# Altium schematic sheet core_power.SchDoc
size A3
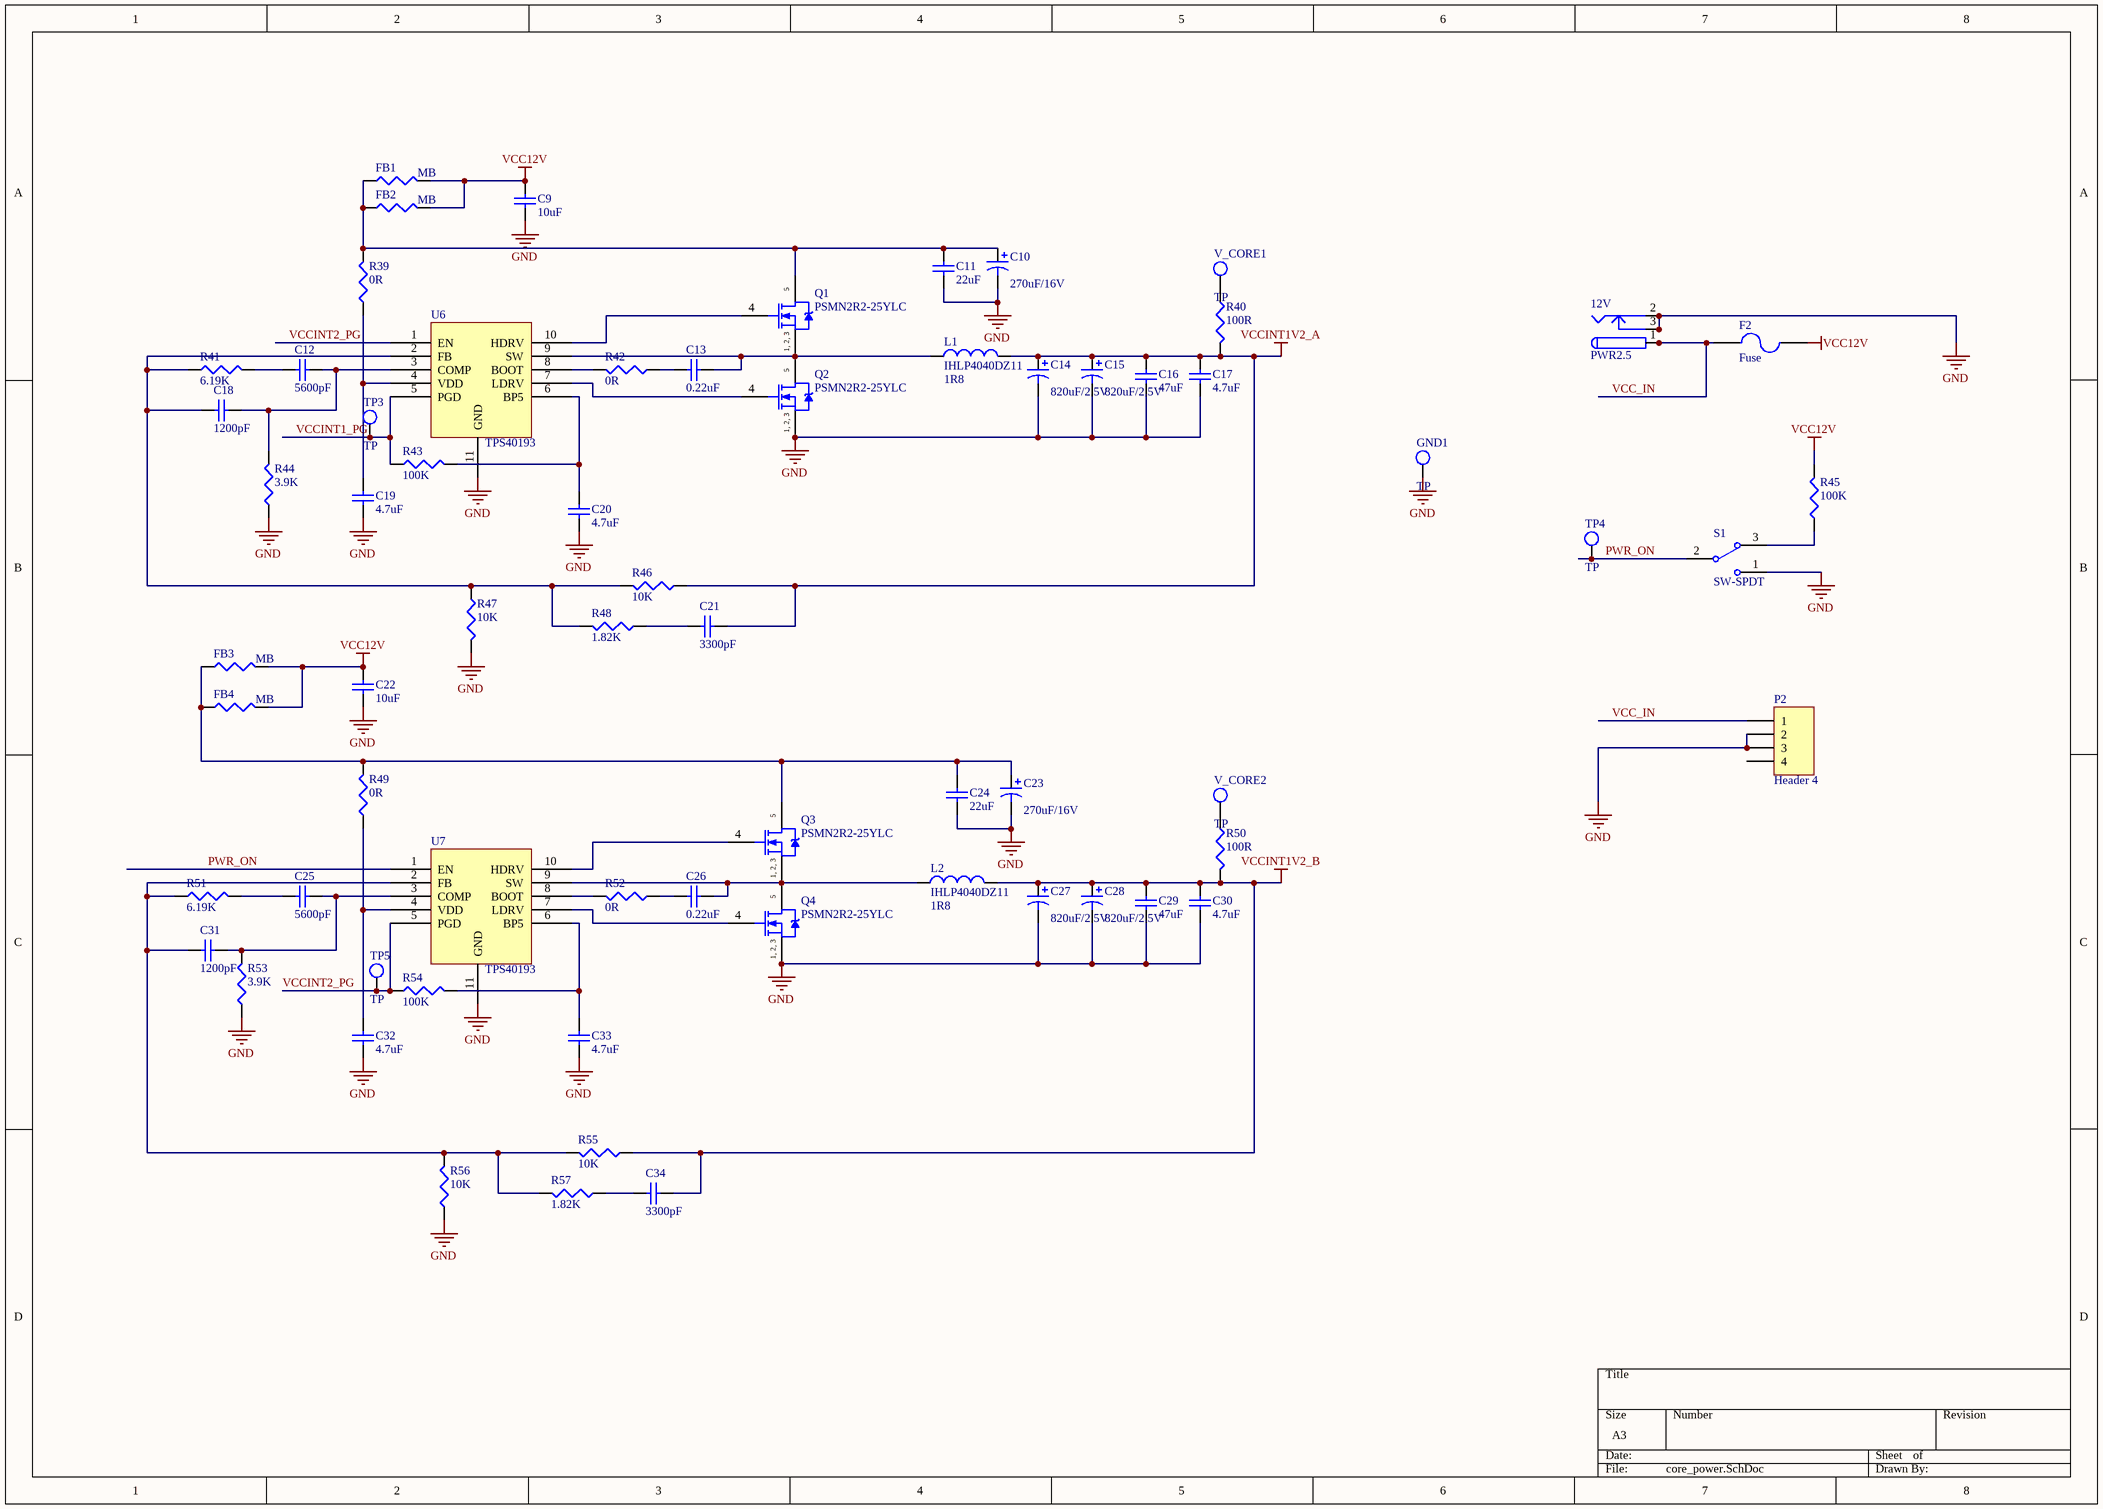
[diagram p0: core_power.SchDoc]

## Parts
12V  PWR2.5  [KLD-0202]
C9  10uF  [CAPC3216N]
C10  270uF/16V  [CAP8X8]
C11  22uF  [CAPC3225N]
C12  5600pF  [CAPC1608N]
C13  0.22uF  [CAPC1608N]
C14  820uF/2.5V  [CAP8X8]
C15  820uF/2.5V  [CAP8X8]
C16  47uF  [CAPC3225N]
C17  4.7uF  [CAPC1608N]
C18  1200pF  [CAPC1608N]
C19  4.7uF  [CAPC2012N]
C20  4.7uF  [CAPC2012N]
C21  3300pF  [CAPC1608N]
C22  10uF  [CAPC3216N]
C23  270uF/16V  [CAP8X8]
C24  22uF  [CAPC3225N]
C25  5600pF  [CAPC1608N]
C26  0.22uF  [CAPC1608N]
C27  820uF/2.5V  [CAP8X8]
C28  820uF/2.5V  [CAP8X8]
C29  47uF  [CAPC3225N]
C30  4.7uF  [CAPC1608N]
C31  1200pF  [CAPC1608N]
C32  4.7uF  [CAPC2012N]
C33  4.7uF  [CAPC2012N]
C34  3300pF  [CAPC1608N]
F2  Fuse  [RESC5025N]
FB1  MB  [INDC3216N]
FB2  MB  [INDC3216N]
FB3  MB  [INDC3216N]
FB4  MB  [INDC3216N]
GND1  TP  [PIN1]
L1  IHLP4040DZ11  value 1R8  [IHLP4040]
L2  IHLP4040DZ11  value 1R8  [IHLP4040]
P2  Header 4  [015244441]
Q1  PSMN2R2-25YLC  [LFPAK]
Q2  PSMN2R2-25YLC  [LFPAK]
Q3  PSMN2R2-25YLC  [LFPAK]
Q4  PSMN2R2-25YLC  [LFPAK]
R39  0R  [RESC1608N]
R40  100R  [RESC1005N]
R41  6.19K  [RESC1608N]
R42  0R  [RESC1608N]
R43  100K  [RESC1005N]
R44  3.9K  [RESC1608N]
R45  100K  [RESC1005N]
R46  10K  [RESC1608N]
R47  10K  [RESC1608N]
R48  1.82K  [RESC1608N]
R49  0R  [RESC1608N]
R50  100R  [RESC1005N]
R51  6.19K  [RESC1608N]
R52  0R  [RESC1608N]
R53  3.9K  [RESC1608N]
R54  100K  [RESC1005N]
R55  10K  [RESC1608N]
R56  10K  [RESC1608N]
R57  1.82K  [RESC1608N]
S1  SW-SPDT  [SW3_S]
TP3  TP  [TP]
TP4  TP  [TP]
TP5  TP  [TP]
U6  TPS40193  [SON10]
U7  TPS40193  [SON10]
V_CORE1  TP  [PIN1]
V_CORE2  TP  [PIN1]

## Nets
GND: 12V.2 12V.2A 12V.2B 12V.3 12V.3A 12V.3B C9.1 C10.2 C11.1 C14.2 C15.2 C16.1 C17.1 C19.2 C20.1 C22.1 C23.2 C24.1 C27.2 C28.2 C29.1 C30.1 C32.1 C33.2 GND1.1(TP) P2.2 P2.3 Q2.1(S) Q2.2(S) Q2.3(S) Q4.1(S) Q4.2(S) Q4.3(S) R44.1 R47.2 R53.1 R56.1 S1.1 U6.11(GND) U7.11(GND)
VCC12V: C9.2 C22.2 F2.2 FB1.2 FB2.2 FB3.2 FB4.2 R45.2
VCCINT1V2_A: C14.1 C15.1 C16.2 C17.2 C21.2 L1.2 R40.2 R46.1
VCCINT1V2_B: C27.1 C28.1 C29.2 C30.2 C34.2 L2.2 R50.2 R55.1
PWR_ON: S1.2 TP4.1(TP) U7.1(EN)
VCC_IN: 12V.1 12V.1A 12V.1B F2.1 P2.1
VCCINT1_PG: R43.1 TP3.1(TP) U6.5(PGD)
VCCINT2_PG: R54.1 TP5.1(TP) U6.1(EN) U7.5(PGD)
NetC10_1: C10.1 C11.2 FB1.1 FB2.1 Q1.5(D) R39.2
NetC12_1: C12.1 C18.1 R44.2 U6.3(COMP)
NetC12_2: C12.2 R41.2
NetC13_1: C13.1 L1.1 Q1.1(S) Q1.2(S) Q1.3(S) Q2.5(D) U6.9(SW)
NetC13_2: C13.2 R42.1
NetC18_2: C18.2 R41.1 R46.2 R47.1 R48.2 U6.2(FB)
NetC19_1: C19.1 R39.1 U6.4(VDD)
NetC20_2: C20.2 R43.2 U6.6(BP5)
NetC21_1: C21.1 R48.1
NetC23_1: C23.1 C24.2 FB3.1 FB4.1 Q3.5(D) R49.2
NetC25_1: C25.1 C31.1 R53.2 U7.3(COMP)
NetC25_2: C25.2 R51.2
NetC26_1: C26.1 L2.1 Q3.1(S) Q3.2(S) Q3.3(S) Q4.5(D) U7.9(SW)
NetC26_2: C26.2 R52.1
NetC31_2: C31.2 R51.1 R55.2 R56.2 R57.2 U7.2(FB)
NetC32_2: C32.2 R49.1 U7.4(VDD)
NetC33_1: C33.1 R54.2 U7.6(BP5)
NetC34_1: C34.1 R57.1
NetQ1_4: Q1.4(G) U6.10(HDRV)
NetQ2_4: Q2.4(G) U6.7(LDRV)
NetQ3_4: Q3.4(G) U7.10(HDRV)
NetQ4_4: Q4.4(G) U7.7(LDRV)
NetR40_1: R40.1 V_CORE1.1(TP)
NetR42_2: R42.2 U6.8(BOOT)
NetR45_1: R45.1 S1.3
NetR50_1: R50.1 V_CORE2.1(TP)
NetR52_2: R52.2 U7.8(BOOT)

Not connected (* = marked no-connect by the designer): P2 4

## Notes on the sheet
- (in symbol HAT216X) 1, 2, 3

## Library data of the parts
12V = PWR2.5: Low Voltage Power Supply Connector; Published: 17-Dec-2003; DatasheetDocument: 09-May-2002; Publisher: Altium Limited; ComponentLink1Description: Manufacturer Link; ComponentLink1URL: http://domino.kycon.com/internet/Products.html
C9 C11-C13 C16-C22 C24-C26 C29-C34 = Cap Semi: Capacitor (Semiconductor SIM Model); Published: 8-Jun-2000; LatestRevisionDate: 29-May-2009; LatestRevisionNote: IPC-7351 Footprint Added.; PackageReference: C1206; Publisher: Altium Limited; PackageDescription: Chip Capacitor
  C9 C22: Value: 10uF
  C11 C24: Value: 22uF
  C12 C25: Value: 5600pF
  C13 C26: Value: 0.22uF
  C16 C29: Value: 47uF
  C17 C19 C20 C30 C32 C33: Value: 4.7uF
  C18 C31: Value: 1200pF
  C21 C34: Value: 3300pF
C10 C14 C15 C23 C27 C28 = Cap Pol1: Polarized Capacitor (Radial); Published: 8-Jun-2000; LatestRevisionDate: 17-Jul-2002; LatestRevisionNote: Re-released for DXP Platform.; PackageReference: RB7.6-15; Publisher: Altium Limited; PackageDescription: Polarized Capacitor (Radial); 2 Leads
  C10 C23: Value: 270uF/16V
  C14 C15 C27 C28: Value: 820uF/2.5V
F2 = Fuse 2: Published: 8-Jun-2000; LatestRevisionDate: 17-Jul-2002; LatestRevisionNote: Re-released for DXP Platform.; PackageReference: PIN-W2/E2.8; Publisher: Altium Limited
FB1-FB4 R39-R57 = Res3: Resistor; Published: 8-Jun-2000; LatestRevisionDate: 29-May-2009; LatestRevisionNote: IPC-7351 Footprint Added.; PackageReference: J1-0603; Publisher: Altium Limited; PackageDescription: Chip Resistor
  FB1-FB4: Value: MB
  R39 R42 R49 R52: Value: 0R
  R40 R50: Value: 100R
  R41 R51: Value: 6.19K
  R43 R45 R54: Value: 100K
  R44 R53: Value: 3.9K
  R46 R47 R55 R56: Value: 10K
  R48 R57: Value: 1.82K
L1 L2 = Inductor: Code_IEC: 1005; Published: 8-Jun-2000; LatestRevisionDate: 29-May-2009; LatestRevisionNote: IPC-7351 Footprint Added.; PackageReference: 0402-A; Publisher: Altium Limited; PackageDescription: Chip Inductor; Code_JEITA: 0402
P2 = Header 4: Header, 4-Pin; LatestRevisionDate: 17-Jul-2002; LatestRevisionNote: Re-released for DXP Platform.; Publisher: Altium Limited
Q1-Q4 = HAT216X
S1 = SW-SPDT: SPDT Subminiature Toggle Switch, Right Angle Mounting, Vertical Actuation; Published: 24-Mar-1999; LatestRevisionDate: 17-Dec-2003; LatestRevisionNote: Schematic revised, PCB Footprint replaced.; DatasheetVersion: 05-Dec-2000; PackageReference: TL36WW15050; Publisher: Altium Limited; PackageDescription: Switch; 4 Leads; ComponentLink1Description: Manufacturer Link; ComponentLink1URL: http://www.apem.com